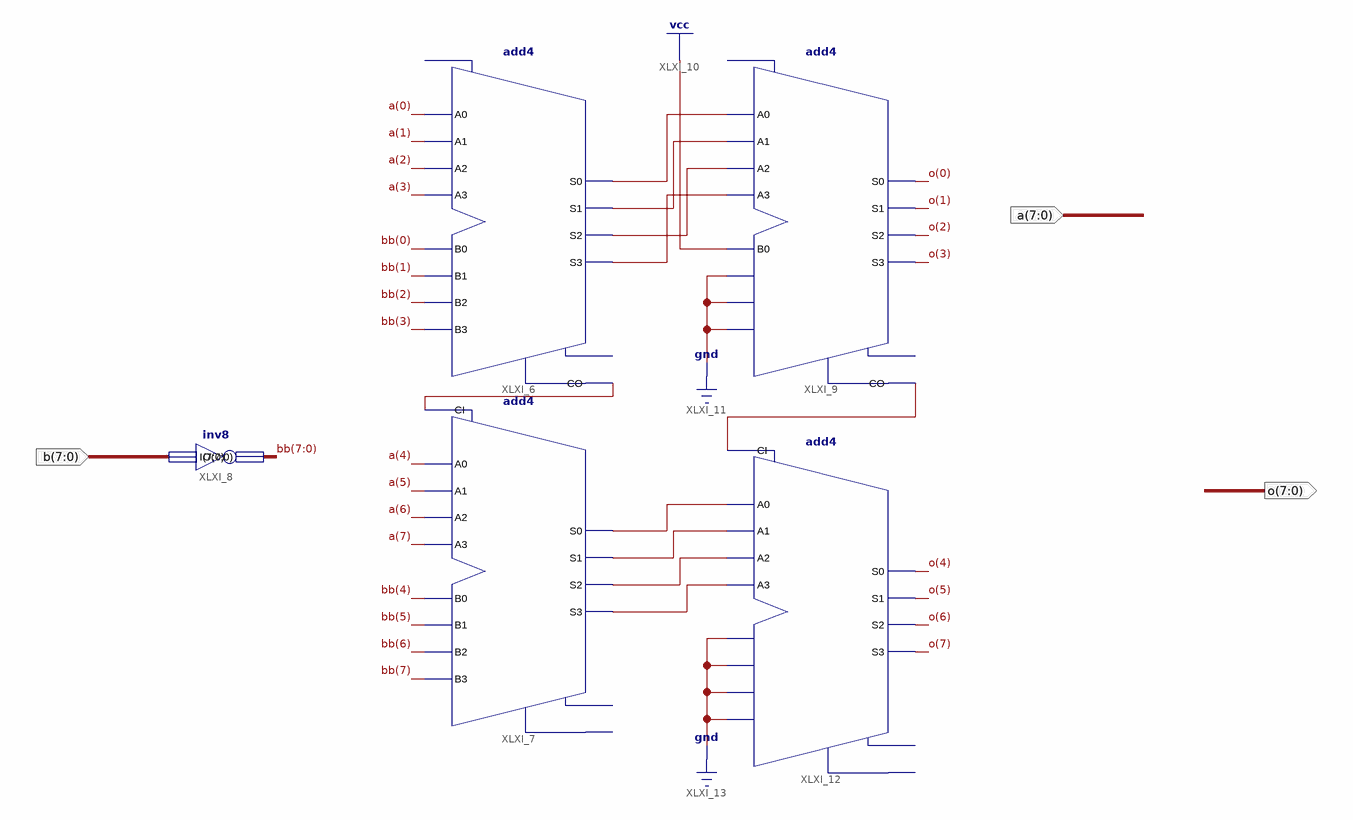
[diagram p0: schematic sheet 1]
// Xilinx ISE schematic sub_8bit_2complement.sch (spartan6) as structural Verilog: 5 symbols, 3 ports
module sub_8bit_2complement (
  input  [7:0] b,
  input  [7:0] a,
  output [7:0] o
);

  wire XLXN_17, XLXN_36, XLXN_43, XLXN_44, XLXN_45, XLXN_46, XLXN_47, XLXN_48, XLXN_49, XLXN_50;
  wire [7:0] bb;

  add4 XLXI_6 (
    .A0(a[0]), .A1(a[1]), .A2(a[2]), .A3(a[3]), .B0(bb[0]), .B1(bb[1]), .B2(bb[2]), .B3(bb[3]), .CO(XLXN_17),
    .S0(XLXN_43), .S1(XLXN_44), .S2(XLXN_45), .S3(XLXN_46));  // open: CI, OFL
  add4 XLXI_7 (
    .A0(a[4]), .A1(a[5]), .A2(a[6]), .A3(a[7]), .B0(bb[4]), .B1(bb[5]), .B2(bb[6]), .B3(bb[7]), .CI(XLXN_17),
    .S0(XLXN_47), .S1(XLXN_48), .S2(XLXN_49), .S3(XLXN_50));  // open: CO, OFL
  inv8 XLXI_8 (.I(b), .O(bb));
  add4 XLXI_9 (
    .A0(XLXN_43), .A1(XLXN_44), .A2(XLXN_45), .A3(XLXN_46), .B0(1'b1), .B1(1'b0), .B2(1'b0), .B3(1'b0),
    .CO(XLXN_36), .S0(o[0]), .S1(o[1]), .S2(o[2]), .S3(o[3]));  // open: CI, OFL
  add4 XLXI_12 (
    .A0(XLXN_47), .A1(XLXN_48), .A2(XLXN_49), .A3(XLXN_50), .B0(1'b0), .B1(1'b0), .B2(1'b0), .B3(1'b0),
    .CI(XLXN_36), .S0(o[4]), .S1(o[5]), .S2(o[6]), .S3(o[7]));  // open: CO, OFL
endmodule
